# Altium schematic sheet concentrator_sch.SchDoc: Concentrator
size A3; DrawnBy: VB; Revision: 1.1; SheetNumber: 1; SheetTotal: 2
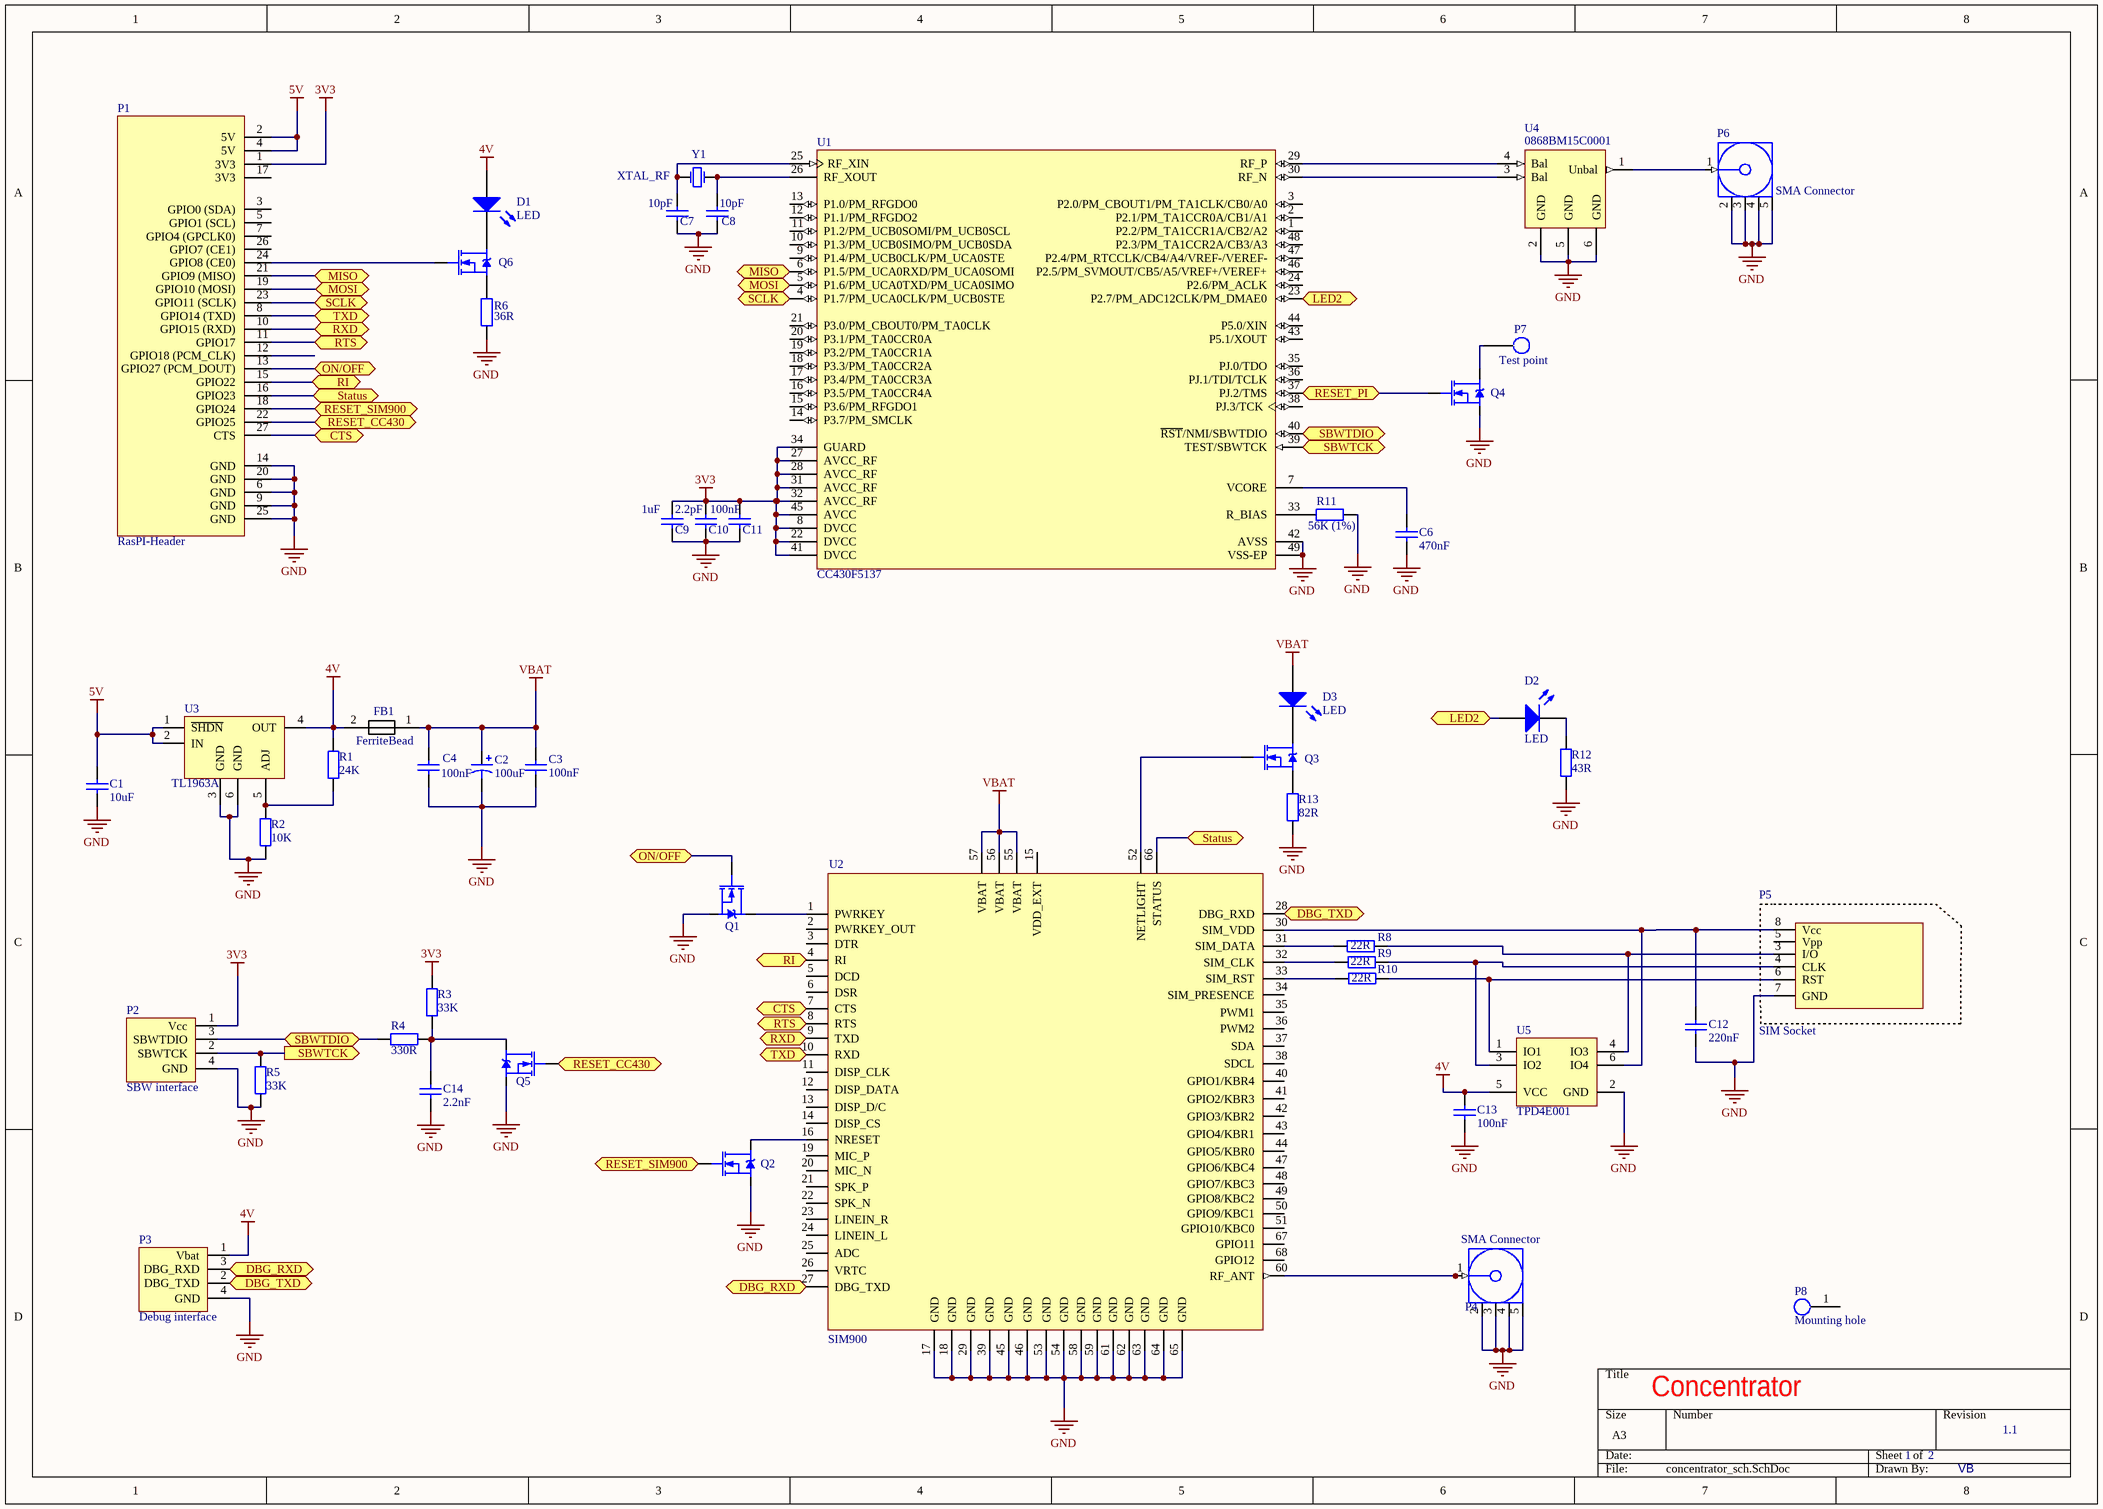
[diagram p0: concentrator_sch.SchDoc]

## Parts
C1  10uF  [0805_CAP]
C2  100uF  [3528_B]
C3  100nF  [0805_CAP]
C4  100nF  [0805_CAP]
C6  470nF  [0805_CAP]
C7  10pF  [0805_CAP]
C8  10pF  [0805_CAP]
C9  1uF  [0805_CAP]
C10  2.2pF  [0805_CAP]
C11  100nF  [0805_CAP]
C12  220nF  [0805_CAP]
C13  100nF  [0805_CAP]
C14  2.2nF  [0805_CAP]
D1  LED  [0805_LED_BLUE]
D2  LED  [0805_LED_GREEN]
D3  LED  [0805_LED_RED]
FB1  FerriteBead  [0805_RES]
P1  RasPI-Header  [FH26p254pitch_thru-hole]
P2  SBW interface  [DF3A-4P-2DS]
P3  Debug interface  [TESTPOINT4]
P4  SMA Connector  [SMA_Connector _Right_Angle]
P5  SIM Socket  [SIM_Card_Socket_Amphenol]
P6  SMA Connector  [SMA_Connector _Right_Angle]
P7  Test point  [TestPoint]
P8  Mounting hole  [MountHole]
Q1  N-MOS  [SOT23]  (value not drawn)
Q2  N-MOS  [SOT23]  (value not drawn)
Q3  N-MOS  [SOT23]  (value not drawn)
Q4  N-MOS  [SOT23]  (value not drawn)
Q5  N-MOS  [SOT23]  (value not drawn)
Q6  N-MOS  [SOT23]  (value not drawn)
R1  24K  [0805_RES]
R2  10K  [0805_RES]
R3  33K  [0805_RES]
R4  330R  [0805_RES]
R5  33K  [0805_RES]
R6  36R  [0805_RES]
R8  22R  [0805_RES]
R9  22R  [0805_RES]
R10  22R  [0805_RES]
R11  56K (1%)  [0805_RES]
R12  43R  [0805_RES]
R13  82R  [0805_RES]
U1  CC430F5137  [TI-RGZ48-4100X4100TP_N]
U2  SIM900  [SIM900]
U3  TL1963A  [6SOT-223]
U4  0868BM15C0001  [JT_Balun]
U5  TPD4E001  [SC70-6]
Y1  XTAL_RF  [xtal_rf]

## Ports
CTS, DBG_RXD (bidir), DBG_TXD (bidir), LED2 (bidir), MISO (bidir), MOSI (bidir), ON/OFF, RESET_CC430, RESET_PI (bidir), RESET_SIM900, RI, RTS, RXD, SBWTCK (out), SBWTDIO (bidir), SCLK (bidir), Status (bidir), TXD

## Nets
3V3: C9.1 C10.2 C11.2 P1.1(3V3) P2.1(Vcc) R3.2 U1.8(DVCC) U1.22(DVCC) U1.27(AVCC_RF) U1.28(AVCC_RF) U1.31(AVCC_RF) U1.32(AVCC_RF) U1.34(GUARD) U1.41(DVCC) U1.45(AVCC)
4V: C13.2 D1.1(A) FB1.2 P3.1(Vbat) R1.2 U3.4(OUT) U5.5(VCC)
5V: C1.2 P1.2(5V) P1.4(5V) U3.1(~{SHDN}) U3.2(IN)
GND: C1.1 C2.2 C3.1 C4.1 C6.1 C7.1 C8.1 C9.2 C10.1 C11.1 C12.1 C13.1 C14.1 P1.6(GND) P1.9(GND) P1.14(GND) P1.20(GND) P1.25(GND) P2.4(GND) P3.4(GND) P4.2(GND) P4.3(GND) P4.4(GND) P4.5(GND) P5.7(GND) P6.2(GND) P6.3(GND) P6.4(GND) P6.5(GND) Q1.2(S) Q2.2(S) Q4.2(S) Q5.2(S) R2.1 R5.1 R6.1 R11.1 R12.1 R13.1 U1.42(AVSS) U1.49(VSS-EP) U2.17(GND) U2.18(GND) U2.29(GND) U2.39(GND) U2.45(GND) U2.46(GND) U2.53(GND) U2.54(GND) U2.58(GND) U2.59(GND) U2.61(GND) U2.62(GND) U2.63(GND) U2.64(GND) U2.65(GND) U3.3(GND) U3.6(GND) U4.2(GND) U4.5(GND) U4.6(GND) U5.2(GND)
VBAT: C2.1 C3.2 C4.2 D3.1(A) FB1.1 U2.55(VBAT) U2.56(VBAT) U2.57(VBAT)
CTS: P1.27(CTS) U2.7(CTS) ; port CTS
DBG_RXD: P3.3(DBG_RXD) U2.27(DBG_TXD) ; port DBG_RXD
DBG_TXD: P3.2(DBG_TXD) U2.28(DBG_RXD) ; port DBG_TXD
LED2: D2.1(A) U1.23(P2.7/PM_ADC12CLK/PM_DMAE0) ; port LED2
MISO: P1.21(GPIO9_(MISO)) U1.6(P1.5/PM_UCA0RXD/PM_UCA0SOMI) ; port MISO
MOSI: P1.19(GPIO10_(MOSI)) U1.5(P1.6/PM_UCA0TXD/PM_UCA0SIMO) ; port MOSI
ON/OFF: P1.13(GPIO27_(PCM_DOUT)) Q1.1(G) ; port ON/OFF
RESET_CC430: P1.22(GPIO25) Q5.1(G) ; port RESET_CC430
RESET_PI: Q4.1(G) U1.37(PJ.2/TMS) ; port RESET_PI
RESET_SIM900: P1.18(GPIO24) Q2.1(G) ; port RESET_SIM900
RI: P1.15(GPIO22) U2.4(RI) ; port RI
RTS: P1.11(GPIO17) U2.8(RTS) ; port RTS
RXD: P1.10(GPIO15_(RXD)) U2.9(TXD) ; port RXD
SBWTCK: P2.2(SBWTCK) R5.2 U1.39(TEST/SBWTCK) ; port SBWTCK
SBWTDIO: P2.3(SBWTDIO) R4.1 U1.40(~{RST}/NMI/SBWTDIO) ; port SBWTDIO
SCLK: P1.23(GPIO11_(SCLK)) U1.4(P1.7/PM_UCA0CLK/PM_UCB0STE) ; port SCLK
Status: P1.16(GPIO23) U2.66(STATUS) ; port Status
TXD: P1.8(GPIO14_(TXD)) U2.10(RXD) ; port TXD
NetC6_2: C6.2 U1.7(VCORE)
NetC7_2: C7.2 U1.25(RF_XIN) Y1.1(OSC1)
NetC8_2: C8.2 U1.26(RF_XOUT) Y1.3(OSC2)
NetC12_2: C12.2 P5.8(Vcc) U2.30(SIM_VDD) U5.6(IO4)
NetC14_2: C14.2 Q5.3(D) R3.1 R4.2
NetD1_2: D1.2(K) Q6.3(D)
NetD2_2: D2.2(K) R12.2
NetD3_2: D3.2(K) Q3.3(D)
NetP1_24: P1.24(GPIO8_(CE0)) Q6.1(G)
NetP4_1: P4.1(Signal) U2.60(RF_ANT)
NetP5_3: P5.3(I/O) R8.2 U5.4(IO3)
NetP5_4: P5.4(CLK) R9.2 U5.3(IO2)
NetP5_6: P5.6(RST) R10.2 U5.1(IO1)
NetP6_1: P6.1(Signal) U4.1(Unbal)
NetP7_1: P7.1 Q4.3(D)
NetQ1_3: Q1.3(D) U2.1(PWRKEY)
NetQ2_3: Q2.3(D) U2.16(NRESET)
NetQ3_1: Q3.1(G) U2.52(NETLIGHT)
NetQ3_2: Q3.2(S) R13.2
NetQ6_2: Q6.2(S) R6.2
NetR1_1: R1.1 R2.2 U3.5(ADJ)
NetR8_1: R8.1 U2.31(SIM_DATA)
NetR9_1: R9.1 U2.32(SIM_CLK)
NetR10_1: R10.1 U2.33(SIM_RST)
NetR11_2: R11.2 U1.33(R_BIAS)
NetU1_29: U1.29(RF_P) U4.4(Bal)
NetU1_30: U1.30(RF_N) U4.3(Bal)

Not connected (* = marked no-connect by the designer): P1 3(GPIO0_(SDA)) 5(GPIO1_(SCL)) 7(GPIO4_(GPCLK0)) 12(GPIO18_(PCM_CLK)) 17(3V3) 26(GPIO7_(CE1)); P5 5(Vpp); P8 1; U1 1(P2.2/PM_TA1CCR1A/CB2/A2) 2(P2.1/PM_TA1CCR0A/CB1/A1) 3(P2.0/PM_CBOUT1/PM_TA1CLK/CB0/A0) 9(P1.4/PM_UCB0CLK/PM_UCA0STE) 10(P1.3/PM_UCB0SIMO/PM_UCB0SDA) 11(P1.2/PM_UCB0SOMI/PM_UCB0SCL) 12(P1.1/PM_RFGDO2) 13(P1.0/PM_RFGDO0) 14(P3.7/PM_SMCLK) 15(P3.6/PM_RFGDO1) 16(P3.5/PM_TA0CCR4A) 17(P3.4/PM_TA0CCR3A) 18(P3.3/PM_TA0CCR2A) 19(P3.2/PM_TA0CCR1A) 20(P3.1/PM_TA0CCR0A) 21(P3.0/PM_CBOUT0/PM_TA0CLK) 24(P2.6/PM_ACLK) 35(PJ.0/TDO) 36(PJ.1/TDI/TCLK) 38(PJ.3/TCK) 43(P5.1/XOUT) 44(P5.0/XIN) 46(P2.5/PM_SVMOUT/CB5/A5/VREF+/VEREF+) 47(P2.4/PM_RTCCLK/CB4/A4/VREF-/VEREF-) 48(P2.3/PM_TA1CCR2A/CB3/A3); U2 2(PWRKEY_OUT) 3(DTR) 5(DCD) 6(DSR) 11(DISP_CLK) 12(DISP_DATA) 13(DISP_D/C) 14(DISP_CS) 15(VDD_EXT) 19(MIC_P) 20(MIC_N) 21(SPK_P) 22(SPK_N) 23(LINEIN_R) 24(LINEIN_L) 25(ADC) 26(VRTC) 34(SIM_PRESENCE) 35(PWM1) 36(PWM2) 37(SDA) 38(SDCL) 40(GPIO1/KBR4) 41(GPIO2/KBR3) 42(GPIO3/KBR2) 43(GPIO4/KBR1) 44(GPIO5/KBR0) 47(GPIO6/KBC4) 48(GPIO7/KBC3) 49(GPIO8/KBC2) 50(GPIO9/KBC1) 51(GPIO10/KBC0) 67(GPIO11) 68(GPIO12)

## Library data of the parts
C1 C3 C4 C6 C12-C14 = Capacitor
  C1: Value: 10uF
  C3 C4 C13: Value: 100nF
  C6: Value: 470nF
  C12: Value: 220nF
  C14: Value: 2.2nF
C2 = Cap-Elco: Polarized Capacitor; Value: 100uF
C7-C11 = CAP: Capacitor
  C7 C8: Value: 10pF
  C9: Value: 1uF
  C10: Value: 2.2pF
  C11: Value: 100nF
D1-D3 = LED: Typical GaAs LED
FB1 = FerriteBead: Ferrite Bead
P1 = RasPI-FHeader: Female Header of raspberry pi 13x2 GPIO connector
P2 = SBW-interface: 4 pole connector for debugging and programming; Supplier: Farnell: 1711329; Type: MOLEX - 87438-0443
P3 = Debug-interface: 4 pole connector for SIM900 serial debug communication; Supplier: Farnell: 1711329; Type: MOLEX - 87438-0443
P4 P6 = SMA-Connector: LRPS PCB Mount Connector, Thru-Hole; Supplier: Farnell: 2096224  / 2096223
P5 = SIM-Socket: SIM socket according to Assman A-SIM-08-06-C-003 model; Supplier: HEStore: 10026633
P7 = TestPoint
P8 = MountHole: Mounting hole - 2.9mm drilled diameter
Q1-Q6 = N-MOS: FDV301N, N CH, 25V, 0.22A, SOT23; Supplier: Lomex: 86-03-44
R1 R2 R6 R8-R10 R12 R13 = Resistor
  R1: Value: 24K
  R2: Value: 10K
  R6: Value: 36R
  R8-R10: Value: 22R
  R12: Value: 43R
  R13: Value: 82R
R3-R5 R11 = RES: Resistor
  R3 R5: Value: 33K
  R4: Value: 330R
  R11: Value: 56K (1%)
U1 = CC430F5137IRGZR: 20 MHz MSP430 SoC with RF Core with 32 KB Flash, 4096 B SRAM and 30 GPIOs, -40 to 85 degC, 48-pin QFN (RGZ), Green (RoHS & no Sb/Br); Manufacturer: Texas Instruments; ADC: Yes; ADC Channels: 6; DMA: 3; Flash(KB): 32; Frequency(MHz): 20; GPIO: 30; Multiplier: 32x32; SRAM(B): 4096; SubFamily: RF SoC Series; Timers - 16-bit: 2; USCI_A (UART/LIN/IrDA/SPI): 1; DatasheetVersion: SLAS554F; PackageVersion: 4204101/F; PackageReference: RGZ48-4100X4100TP; PackageDescription: 48-Pin Plastic Flat Pack, Body 7 x 7 mm, Pitch 0.5 mm; Supplier 1: Digi-Key; Supplier Part Number 1: 296-27420-2-ND; Supplier 2: Digi-Key; Supplier Part Number 2: 296-27420-1-ND; Supplier 3: Digi-Key; Supplier Part Number 3: 296-27420-6-ND; Supplier 4: Newark; Supplier Part Number 4: 68R5912; Supplier 5: Mouser; Supplier Part Number 5: 595-CC430F5137IRGZR; Brown Out Reset: Yes; Comparators: Yes; Eco-Plan: Green (RoHS & no Sb/Br); Real-Time Clock: Yes; SVS: Yes; Temp Sensor: Yes; USCI_B (I2C & SPI): 1; Watchdog: Yes; Mounting Technology: Surface Mount; Code_JEDEC: MO-220; PartNumber: CC430F5137IRGZR; ComponentLink1Description: Manufacturer URL; ComponentLink1URL: http://www.ti.com/; ComponentLink2Description: Datasheet; ComponentLink2URL: http://www.ti.com/general/docs/lit/getliterature.tsp?genericPartNumber=CC430F5137&fileType=pdf; ComponentLink3Description: Package Specification; ComponentLink3URL: http://www.ti.com/lit/ds/symlink/sn75dp139.pdf; Supplier 6: TI Sample (CC430F5137IRGZR)
U2 = SIM900: SIM900 GSM modul; Supplier: TME
U3 = TL1963A: Adjustable LDO up to 1.5A; Supplier: TI sample
U4 = 0868BM15C0001: 868MHz Impedance Matched/Balun/BPF Integrated Component for T.I. CC110X, CC430, etc.; Manufacturer: Johanson Technology; PackageReference: 0805; Supplier 1: Farnell; Mounting Technology: Surface Mount; PartNumber: 0868BM15C0001
U5 = TPD4E001DCKR: Low-Capacitance + / - 15-kV ESD Protection Array for High-Speed Data Interfaces, 4 Channels, -40 to +85 degC, 6-pin SOT70 (DCK), Green (RoHS & no Sb/Br); Manufacturer: Texas Instruments; 1394 / Firewire: TRUE; Breakdown Voltage(Min)(V): 11; IEC 61000-4-2 Air-Gap(+/- kV): 15; IEC 61000-4-2 Contact(+/- kV): 8; IO Capacitance(Typ)(pF): 1.5; SubFamily: ESD Solution; DatasheetVersion: SLLS682G; PackageVersion: revG, Jan-2007; PackageReference: DCK6; PackageDescription: 6-Pin Plastic Small-Outline Package, 2 x 1.3 mm Body, 0.65 mm Pitch, 2.1 mm Lead Span; Supplier 1: Digi-Key; Supplier Part Number 1: 296-28779-2-ND; Supplier 2: Digi-Key; Supplier Part Number 2: 296-28779-1-ND; Supplier 3: Digi-Key; Supplier Part Number 3: 296-28779-6-ND; Supplier 4: Newark; Supplier Part Number 4: 48T4664; Supplier 5: Mouser; Supplier Part Number 5: 595-TPD4E001DCKR; Eco-Plan: Green (RoHS & no Sb/Br); IO Leakage Current(nA): 1.5; Serial ATA / eSATA: TRUE; USB High Speed: TRUE; Mounting Technology: Surface Mount; Code_JEDEC: MO-203-AB; PartNumber: TPD4E001DCKR; ComponentLink1Description: Datasheet; ComponentLink1URL: http://www.ti.com/general/docs/lit/getliterature.tsp?genericPartNumber=TPD4E001&fileType=pdf; ComponentLink2Description: URL Link1; ComponentLink2URL: SamplesURL:http://www.ti.com/product/tpd4e001#samples
Y1 = XTAL_RF: Crystal Oscillator; Published: 8-Jun-2000; LatestRevisionDate: 17-Jul-2002; LatestRevisionNote: Re-released for DXP Platform.; PackageReference: R38; Publisher: Altium Limited; PackageDescription: Crystal, Thru-Hole; 2 Leads; Body 3.1 x 8.2 mm (Dia.xH); Supplier: Farnell: 1841998  (26M); Supplier: Lomex: 40-02-49 (32768Hz)